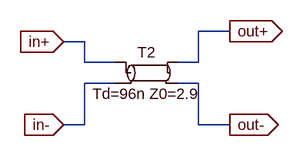
[diagram p0: schematic 16AWG_twisted_pair.tline.asc]
16AWG_twisted_pair.tline.asc, the LTspice schematic file:
Version 4
SHEET 1 944 680
WIRE 256 176 208 176
WIRE 32 192 0 192
WIRE 32 224 32 192
WIRE 80 224 32 224
WIRE 208 224 208 176
WIRE 208 224 176 224
WIRE 80 256 32 256
WIRE 208 256 176 256
WIRE 32 320 32 256
WIRE 32 320 0 320
WIRE 208 320 208 256
WIRE 256 320 208 320
FLAG 256 176 out+
IOPIN 256 176 Out
FLAG 256 320 out-
IOPIN 256 320 Out
FLAG 0 192 in+
IOPIN 0 192 In
FLAG 0 320 in-
IOPIN 0 320 In
SYMBOL tline 128 240 R0
SYMATTR InstName T2
SYMATTR Value Td=96n Z0=2.9

The netlist it stands for:
* 16AWG_twisted_pair.tline.asc
T2 in+ in- out+ out- Td=96n Z0=2.9
.backanno
.end